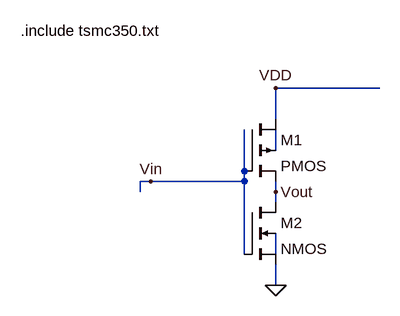
[diagram p0: schematic symb.asc]
symb.asc, the LTspice schematic file:
Version 4
SHEET 1 880 680
WIRE 560 176 400 176
WIRE 400 224 400 176
WIRE 400 272 400 240
WIRE 352 304 352 240
WIRE 208 320 192 320
WIRE 352 320 352 304
WIRE 352 320 208 320
WIRE 192 336 192 320
WIRE 400 336 400 320
WIRE 400 352 400 336
WIRE 352 432 352 320
WIRE 400 432 400 400
WIRE 400 480 400 448
FLAG 400 480 0
FLAG 208 320 Vin
FLAG 400 176 VDD
FLAG 400 336 Vout
SYMBOL pmos4 352 224 R0
SYMATTR InstName M1
SYMATTR Value2 l=350n w=2u
SYMBOL nmos4 352 352 R0
SYMATTR InstName M2
SYMATTR Value2 l=350n w=1u
TEXT 8 88 Left 2 !.include tsmc350.txt

The netlist it stands for:
* symb.asc
M1 VDD Vin Vout N001 PMOS l=350n w=2u
M2 Vout Vin 0 N002 NMOS l=350n w=1u
.model NMOS NMOS
.model PMOS PMOS
.lib standard.mos
.include tsmc350.txt
.backanno
.end